# Altium schematic sheet Sheet1.SchDoc
size A0
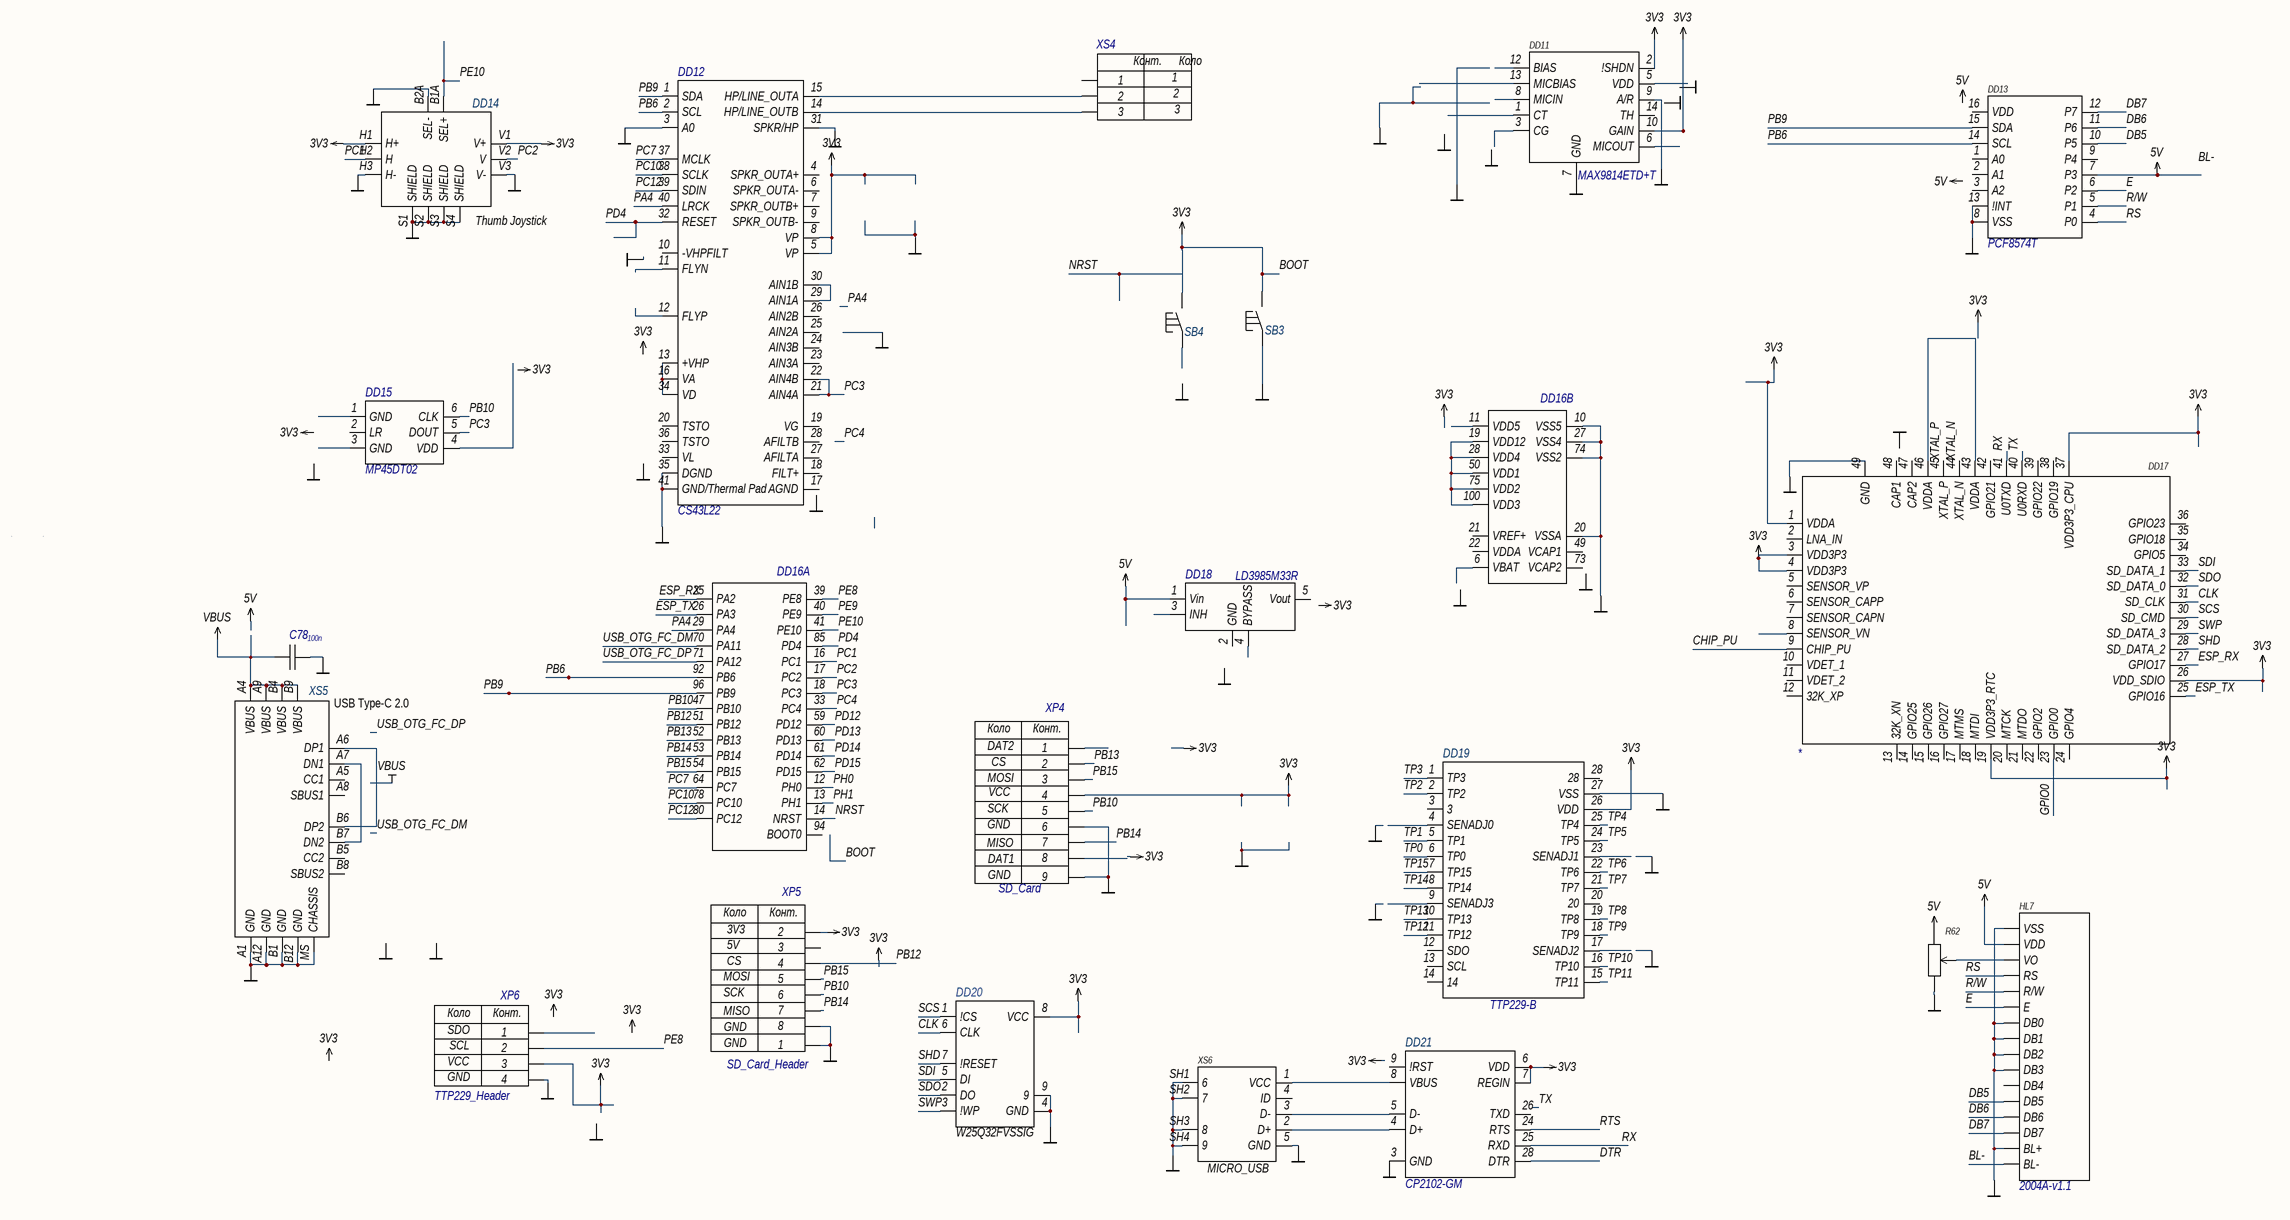
[diagram p0: Sheet1.SchDoc]

## Parts
C78  value 100n  [C_0603]
DD11  Name: MAX9814ETD+T  [MAX9814]  (hidden comment: MAX9814ETD+T Analog Devices Inc./Maxim Integrated)
DD12  (no value)  [CS43L22]
DD13  Name: PCF8574T  [PCF8574TS]  (hidden comment: PCF8574T NXP USA Inc.)
DD14  Thumb Joystick  [XDCR_COM-09032]
DD15  (no value)  [MP45DT02]
DD16  (no value)  [STM32F407VGT6]  (parts A,B of 2)
DD17  * *  [ESP]  (value not drawn)
DD18  (no value)  [LD3985M33R]
DD19  CP2102-GM  [28-SSOP]  (value not drawn)
DD20  W25Q32FVSSIG  [W25QxxxJVEIQ-127P800X80_MED]
DD21  CP2102-GM  [QFN-28_5x5mm]
HL7  Name: 2004A-v1.1  [lcd]  (hidden comment: LCD)
R62  RHEOSTAT  [RHEOSTAT]  (value not drawn)
SB3  (no value)  [button2]
SB4  (no value)  [button2]
XP4  SD_Card  [xp9]
XP5  SD_Card_Header  [xp8]
XP6  TTP229_Header  [xp4]
XS4  SJ1-2503A Same Sky (Formerly CUI Devices)  [XS_AUDIO]  (value not drawn)
XS5  USB Type-C 2.0  [SAMESKY_UJ20-C-H-G-SMT-1-P16-TR]
XS6  MICRO_USB  [MICRO_USB]

## Nets
5V: DD13.7(P3) DD18.1(Vin) HL7.2(VDD) R62.1
BOOT: DD11.2(!SHDN) DD11.10(GAIN) DD12.5(VP) DD12.8(VP) DD14.H1(H+) DD14.V1(V+) DD16.14(NRST) DD17.1(VDDA) DD17.3(VDD3P3) DD17.4(VDD3P3) DD17.19(VDD3P3_RTC) DD17.26(VDD_SDIO) DD17.37(VDD3P3_CPU) DD19.26(VDD) DD20.8(VCC) DD21.6(VDD) DD21.7(REGIN) SB3.2 SB4.2 XP4.4 XP5.2 XP6.3  [also labelled 3V3, NRST]
GND: C78.2 DD11.7(GND) DD11.9(A/R) DD12.3(A0) DD12.31(SPKR/HP) DD12.35(DGND) DD12.41(GND/Thermal_Pad) DD13.8(VSS) DD13.13(!INT) DD14.B2A(SEL-) DD14.H3(H-) DD14.S1(SHIELD) DD14.S2(SHIELD) DD14.S3(SHIELD) DD14.S4(SHIELD) DD14.V3(V-) DD16.10(VSS5) DD16.20(VSSA) DD16.27(VSS4) DD16.74(VSS2) DD17.49(GND) DD19.27(VSS) DD20.4(GND) DD20.9 DD21.3(GND) HL7.1(VSS) HL7.7(DB0) HL7.8(DB1) HL7.9(DB2) HL7.10(DB3) HL7.15(BL+) R62.2 SB3.1 XP4.6 XP4.9 XP5.1 XP5.8 XP6.4 XS5.A1(GND) XS5.A12(GND) XS5.B1(GND) XS5.B12(GND) XS5.MS(CHASSIS) XS6.5(GND) XS6.SH1(6) XS6.SH2(7) XS6.SH3(8) XS6.SH4(9)
VBUS: C78.1 XS5.A4(VBUS) XS5.A9(VBUS) XS5.B4(VBUS) XS5.B9(VBUS)
BL-: HL7.16(BL-)
CHIP_PU: DD17.9(CHIP_PU)
CLK: DD17.31(SD_CLK) DD20.6(CLK)
DB5: DD13.10(P5) HL7.12(DB5)
DB6: DD13.11(P6) HL7.13(DB6)
DB7: DD13.12(P7) HL7.14(DB7)
DTR: DD21.28(DTR)
E: DD13.6(P2) HL7.6(E)
ESP_RX: DD16.25(PA2) DD17.27(GPIO17)
ESP_TX: DD16.26(PA3) DD17.25(GPIO16)
GPIO0: DD17.23(GPIO0)
PA4: DD12.40(LRCK) DD16.29(PA4)
PB6: DD12.2(SCL) DD13.14(SCL) DD16.92(PB6)
PB9: DD12.1(SDA) DD13.15(SDA) DD16.96(PB9)
PB10: DD15.6(CLK) DD16.47(PB10) XP4.5 XP5.6
PB12: DD16.51(PB12) XP5.4
PB13: DD16.52(PB13) XP4.2
PB14: DD16.53(PB14) XP4.7 XP5.7
PB15: DD16.54(PB15) XP4.3 XP5.5
PC1: DD14.H2(H) DD16.16(PC1)
PC2: DD14.V2(V) DD16.17(PC2)
PC3: DD12.21(AIN4A) DD12.22(AIN4B) DD15.5(DOUT) DD16.18(PC3)
PC4: DD16.33(PC4)
PC7: DD12.37(MCLK) DD16.64(PC7)
PC10: DD12.38(SCLK) DD16.78(PC10)
PC12: DD12.39(SDIN) DD16.80(PC12)
PD4: DD12.32(RESET) DD16.85(PD4)
PD12: DD16.59(PD12)
PD13: DD16.60(PD13)
PD14: DD16.61(PD14)
PD15: DD16.62(PD15)
PE8: DD16.39(PE8) XP6.2
PE9: DD16.40(PE9)
PE10: DD14.B1A(SEL+) DD16.41(PE10)
PH0: DD16.12(PH0)
PH1: DD16.13(PH1)
R/W: DD13.5(P1) HL7.5(R/W)
RS: DD13.4(P0) HL7.4(RS)
RTS: DD21.24(RTS)
RX: DD17.41(U0TXD) DD21.25(RXD)
SCS: DD17.30(SD_CMD) DD20.1(!CS)
SDI: DD17.33(SD_DATA_1) DD20.5(DI)
SDO: DD17.32(SD_DATA_0) DD20.2(DO)
SHD: DD17.28(SD_DATA_2) DD20.7(!RESET)
SWP: DD17.29(SD_DATA_3) DD20.3(!WP)
TP0: DD19.6(TP0)
TP1: DD19.5(TP1)
TP2: DD19.2(TP2)
TP3: DD19.1(TP3)
TP4: DD19.25(TP4)
TP5: DD19.24(TP5)
TP6: DD19.22(TP6)
TP7: DD19.21(TP7)
TP8: DD19.19(TP8)
TP9: DD19.18(TP9)
TP10: DD19.16(TP10)
TP11: DD19.15(TP11)
TP12: DD19.11(TP12)
TP13: DD19.10(TP13)
TP14: DD19.8(TP14)
TP15: DD19.7(TP15)
TX: DD17.40(U0RXD)
USB_OTG_FC_DM: DD16.70(PA11)
USB_OTG_FC_DP: DD16.71(PA12)
XTAL_N: DD17.44(XTAL_N)
XTAL_P: DD17.45(XTAL_P)
NetDD12_13: DD12.13(+VHP) DD12.16(VA) DD12.34(VD)
NetDD12_14: DD12.14(HP/LINE_OUTB) XS4.3
NetDD12_15: DD12.15(HP/LINE_OUTA) XS4.2
NetDD12_29: DD12.29(AIN1A) DD12.30(AIN1B)
NetDD16_19: DD16.19(VDD12) DD16.28(VDD4) DD16.50(VDD1) DD16.75(VDD2) DD16.100(VDD3)
NetDD17_43: DD17.43(VDDA) DD17.46(VDDA)
NetDD21_4: DD21.4(D+) XS6.2(D+)
NetDD21_5: DD21.5(D-) XS6.3(D-)
NetDD21_8: DD21.8(VBUS) XS6.1(VCC)
NetHL7_3: HL7.3(VO) R62.3
NetXS5_A6: XS5.A6(DP1) XS5.B6(DP2)
NetXS5_A7: XS5.A7(DN1) XS5.B7(DN2)

Not connected (* = marked no-connect by the designer): DD11 1(CT) 3(CG) 5(VDD) 6(MICOUT) 8(MICIN) 12(BIAS) 13(MICBIAS) 14(TH); DD12 4(SPKR_OUTA+) 6(SPKR_OUTA-) 7(SPKR_OUTB+) 9(SPKR_OUTB-) 10(-VHPFILT) 11(FLYN) 12(FLYP) 17(AGND) 18(FILT+) 19(VG) 20(TSTO) 23(AIN3A) 24(AIN3B) 25(AIN2A) 26(AIN2B) 27(AFILTA) 28(AFILTB) 33(VL) 36(TSTO); DD13 1(A0) 2(A1) 3(A2) 9(P4) 16(VDD); DD15 1(GND) 2(LR) 3(GND) 4(VDD); DD16 6(VBAT) 11(VDD5) 21(VREF+) 22(VDDA) 49(VCAP1) 73(VCAP2) 94(BOOT0); DD17 2(LNA_IN) 5(SENSOR_VP) 6(SENSOR_CAPP) 7(SENSOR_CAPN) 8(SENSOR_VN) 10(VDET_1) 11(VDET_2) 12(32K_XP) 13(32K_XN) 14(GPIO25) 15(GPIO26) 16(GPIO27) 17(MTMS) 18(MTDI) 20(MTCK) 21(MTDO) 22(GPIO2) 24(GPIO4) 34(GPIO5) 35(GPIO18) 36(GPIO23) 38(GPIO19) 39(GPIO22) 42(GPIO21) 47(CAP2) 48(CAP1); DD18 2(GND) 3(INH) 4(BYPASS) 5(Vout); DD19 3 4(SENADJ0) 9(SENADJ3) 12(SDO) 13(SCL) 14 17(SENADJ2) 20 23(SENADJ1) 28; DD21 9(!RST) 26(TXD); HL7 11(DB4); SB4 1; XP4 1 8; XP5 3; XP6 1; XS4 1; XS5 A5(CC1) A8(SBUS1) B5(CC2) B8(SBUS2); XS6 4(ID)

## Notes on the sheet
- Labels drawn without touching a wire or pin: 3V3, 5V, BL-, GND
- (in symbol 4_PIN_HEADER_SDO) Коло; Конт.; SDO; SCL; VCC; GND
- (in symbol 8_PIN_HEADER) Коло; Конт.; 3V3; 5V; CS; MOSI; SCK; MISO; GND
- (in symbol 9_PIN_HEADER) Коло; Конт.; DAT2; CS; MOSI; VCC; SCK; GND; MISO; DAT1
- (in symbol JACK) Конт.; Коло

## Library data of the parts
C78 = C_0603: Manufacturer: TDK Corporation; Temp_Coef: X7R; Voltage: 50 В; Tolerance: 10%; Package: 0603
DD11 = MAX9814: Manufacturer: Analog Devices Inc./Maxim Integrated
DD12 = CS43L22: Manufaturer: Cirrus Logic Inc.; Name: CS43L22
DD13 = PCF8574TS: Manufacturer: NXP USA Inc.
DD14 = COM-09032: Thumb Joystick, 1568-09032-ND; Manufacturer: SparkFun Electronics; Availability: Unavailable; Part Number: COM-09032
DD15 = MP45DT02: Manufacturer: STMicroelectronics; Name: MP45DT02
DD16 = STM32F407VGT6_SHORT: Manufacturer: STMicroelectronics; Name: STM32F407VGT6
DD17 = ESP32-DOWDQ6: Name: *; Manufacturer: *
DD18 = LD3985M33R: Manufacturer: STMicroelectronics; Name: LD3985M33R
DD19 = TTP229-B: Manufacturer: Tontek Design Technology; Package: 28-SSOP; Part Number: TTP229-B
DD20 = W25Q256JVEI1: FLASH - NOR Memory IC 256Mb SPI - Quad I/O, QPI 133 MHz 8-WSON; Manufacturer: Winbond Electronics; Package: SOIC-8; Part Number: W25Q32FVSSIG
DD21 = CP2102-GM: USB 2.0 to UART, 28-QFN (5x5); Manufacturer: Silicon Labs; Package: QFN-28 Silicon Labs; Part Number: CP2102-GM
HL7 = LCD: Manufacturer: Shenzhen Eone Electronics
R62 = RHEOSTAT: Manufacturer: Bourns Inc.; Name: PTV09A-2015U-B103
SB3 SB4 = button2: Manufacturer: Würth Elektronik; Name: 430182043816
XP4 = 9_PIN_HEADER: 475900001; Manufacturer: Samtec Inc.; Name: TS-111-T-AA
XP5 = 8_PIN_HEADER: 475900001; Manufacturer: Samtec Inc.; Name: TS-111-T-AA
XP6 = 4_PIN_HEADER_SDO: CN3; Manufacturer: Samtec Inc.; Name: TS-104-T-A
XS4 = JACK: Name: SJ1-2503A; Manufacturer: Same Sky (Formerly CUI Devices)
XS5 = USB Type-C 2.0: Conn USB 2.0 Type C RCP 16 POS 0.85mm Solder RA Thru-Hole 16 Terminal 1 Port T/R; pin to pad: A1>B1_A12 A4>A4_B9 A9>B4_A9 A12>A1_B12 B1>A1_B12 B4>B4_A9 B9>A4_B9 B12>B1_A12; Manufacturer: Same Sky; Part Number: UJ20-C-H-G-SMT-TR
XS6 = MICRO_USB: Manufacturer: Amphenol ICC (FCI); Name: 10104110-0001LF